# Altium schematic sheet AS_Node_Outputs.SchDoc
size A4
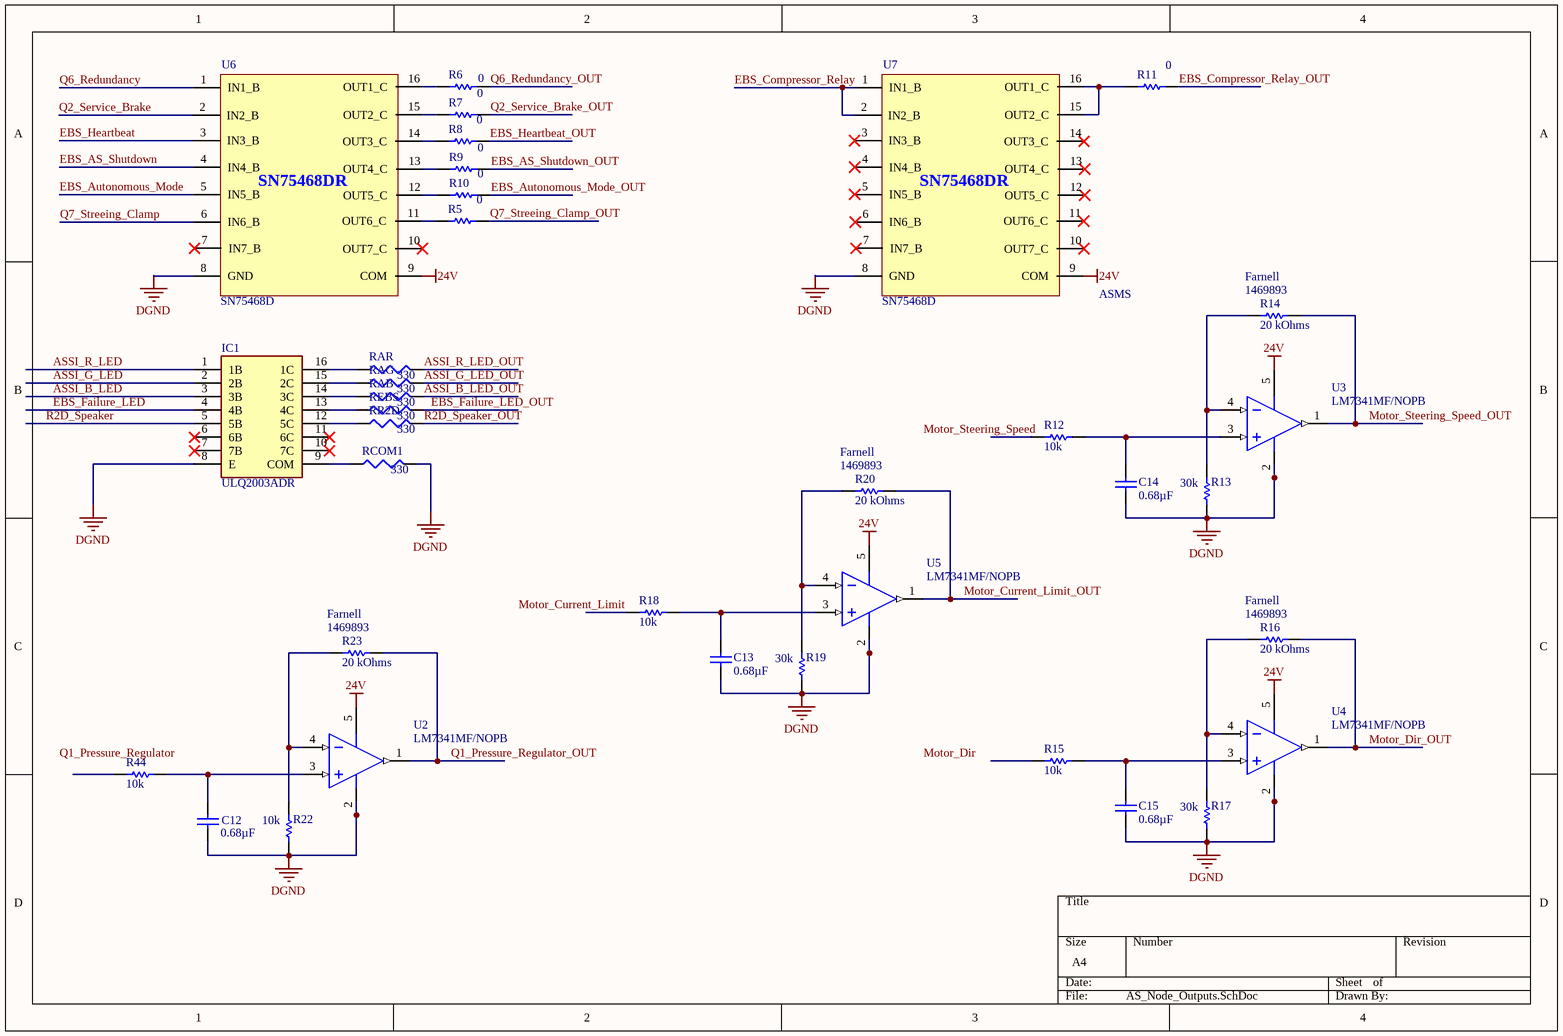
[diagram p0: AS_Node_Outputs.SchDoc]

## Parts
C12  0.68µF  [dV_C0805]
C13  0.68µF  [dV_C0805]
C14  0.68µF  [dV_C0805]
C15  0.68µF  [dV_C0805]
IC1  ULQ2003ADR  [SOIC127P600X175-16N]
R5  0  [dV_R0805]
R6  0  [dV_R0805]
R7  0  [dV_R0805]
R8  0  [dV_R0805]
R9  0  [dV_R0805]
R10  0  [dV_R0805]
R11  0  [dV_R0805]
R12  10k  [dV_R0805]
R13  30k  [dV_R0805]
R14  20 kOhms  Supplier Part Number: 1469893  Supplier: Farnell  [dV_R0805]
R15  10k  [dV_R0805]
R16  20 kOhms  Supplier Part Number: 1469893  Supplier: Farnell  [dV_R0805]
R17  30k  [dV_R0805]
R18  10k  [dV_R0805]
R19  30k  [dV_R0805]
R20  20 kOhms  Supplier Part Number: 1469893  Supplier: Farnell  [dV_R0805]
R22  10k  [dV_R0805]
R23  20 kOhms  Supplier Part Number: 1469893  Supplier: Farnell  [dV_R0805]
R44  10k  [dV_R0805]
RAB  value 330  [SMD-0805-RES]  (hidden comment: Res3)
RAG  value 330  [SMD-0805-RES]  (hidden comment: Res3)
RAR  value 330  [SMD-0805-RES]  (hidden comment: Res3)
RCOM1  value 330  [SMD-0805-RES]  (hidden comment: Res3)
REBS  value 330  [SMD-0805-RES]  (hidden comment: Res3)
RR2D  value 330  [SMD-0805-RES]  (hidden comment: Res3)
U2  LM7341MF/NOPB  [SOT-23-5]
U3  LM7341MF/NOPB  [SOT-23-5]
U4  LM7341MF/NOPB  [SOT-23-5]
U5  LM7341MF/NOPB  [SOT-23-5]
U6  SN75468D  [ULQ2001]
U7  SN75468D  [ULQ2001]

## Nets
24V: U2.5(VDD) U3.5(VDD) U4.5(VDD) U5.5(VDD) U6.9(COM) U7.9(COM)
DGND: C12.1 C13.1 C14.1 C15.1 IC1.8(E) R13.2 R17.2 R19.2 R22.2 RCOM1.2 U2.2(GND) U3.2(GND) U4.2(GND) U5.2(GND) U6.8(GND) U7.8(GND)
ASSI_B_LED: IC1.3(3B)
ASSI_B_LED_OUT: RAB.2
ASSI_G_LED: IC1.2(2B)
ASSI_G_LED_OUT: RAG.2
ASSI_R_LED: IC1.1(1B)
ASSI_R_LED_OUT: RAR.2
EBS_AS_Shutdown: U6.4(IN4_B)
EBS_AS_Shutdown_OUT: R9.2
EBS_Autonomous_Mode: U6.5(IN5_B)
EBS_Autonomous_Mode_OUT: R10.2
EBS_Compressor_Relay: U7.1(IN1_B) U7.2(IN2_B)
EBS_Compressor_Relay_OUT: R11.2
EBS_Failure_LED: IC1.4(4B)
EBS_Failure_LED_OUT: REBS.2
EBS_Heartbeat: U6.3(IN3_B)
EBS_Heartbeat_OUT: R8.2
Motor_Current_Limit_OUT: R20.2 U5.1(OUT)
Motor_Dir_OUT: R16.2 U4.1(OUT)
Motor_Steering_Speed_OUT: R14.2 U3.1(OUT)
Q1_Pressure_Regulator_OUT: R23.2 U2.1(OUT)
Q2_Service_Brake: U6.2(IN2_B)
Q2_Service_Brake_OUT: R7.2
Q6_Redundancy: U6.1(IN1_B)
Q6_Redundancy_OUT: R6.2
Q7_Streeing_Clamp: U6.6(IN6_B)
Q7_Streeing_Clamp_OUT: R5.2
R2D_Speaker: IC1.5(5B)
R2D_Speaker_OUT: RR2D.2
NetC12_2: C12.2 R44.2 U2.3(IN+)
NetC13_2: C13.2 R18.2 U5.3(IN+)
NetC14_2: C14.2 R12.2 U3.3(IN+)
NetC15_2: C15.2 R15.2 U4.3(IN+)
NetIC1_9: IC1.9(COM) RCOM1.1
NetIC1_12: IC1.12(5C) RR2D.1
NetIC1_13: IC1.13(4C) REBS.1
NetIC1_14: IC1.14(3C) RAB.1
NetIC1_15: IC1.15(2C) RAG.1
NetIC1_16: IC1.16(1C) RAR.1
NetR5_1: R5.1 U6.11(OUT6_C)
NetR6_1: R6.1 U6.16(OUT1_C)
NetR7_1: R7.1 U6.15(OUT2_C)
NetR8_1: R8.1 U6.14(OUT3_C)
NetR9_1: R9.1 U6.13(OUT4_C)
NetR10_1: R10.1 U6.12(OUT5_C)
NetR11_1: R11.1 U7.15(OUT2_C) U7.16(OUT1_C)
NetR13_1: R13.1 R14.1 U3.4(IN-)
NetR16_1: R16.1 R17.1 U4.4(IN-)
NetR19_1: R19.1 R20.1 U5.4(IN-)
NetR22_1: R22.1 R23.1 U2.4(IN-)

Not connected (* = marked no-connect by the designer): IC1 6(6B)* 7(7B)* 10(7C)* 11(6C)*; R12 1; R15 1; R18 1; R44 1; U6 7(IN7_B)* 10(OUT7_C)*; U7 3(IN3_B)* 4(IN4_B)* 5(IN5_B)* 6(IN6_B)* 7(IN7_B)* 10(OUT7_C)* 11(OUT6_C)* 12(OUT5_C)* 13(OUT4_C)* 14(OUT3_C)*

## Notes on the sheet
- (near U7) ASMS
- Labels drawn without touching a wire or pin: Motor_Current_Limit, Motor_Dir, Motor_Steering_Speed, Q1_Pressure_Regulator

## Library data of the parts
C12-C15 = Cap: Manufacturer: KEMET; Manufacturer Part Number: C0805C684J3NACTU; Ceramic Capacitor Case: 0805 [2012 Metric]; Voltage Rating: 25; Capacitance Tolerance: ± 5%; Dielectric Characteristic: X8; Product Range: C Series; SVHC: No SVHC (15-Jun-2015)<!--FANDB--><div class="features-and-benefits-container"><div class="features-and-benefits-desc-container"><span class="features-and-benefits-container-desc">SMD Multilayer Ceramic Capacitor, 0805 [2012 Metric], 0.68 µF, 25 V, ± 5%, X8L, C Series</span></div><div class="features-and-benefits-description"><span class="features-benefits-value">The X8L dielectric features a 150°C maximum operating temperature and is considered "general purpose high temperature." These components are fixed, ceramic dielectric capacitors suited for high temperature bypass and decoupling applications or frequency discriminating circuits where Q and stability of capacitance characteristics are not critical. X8L exhibits a predictable change in capacitance with respect to time and voltage and boasts a minimal change in capacitance with reference to ambient temperature up to 125°C. Beyond 125°C X8L displays a wider variation in capacitance. Capacitance change is limited to ±15% from ?55°C to +125°C and +15, ?40% from 125°C to 150°C.</span></div><div class="features-and-benefits-list"><ul class="features-and-benefits-list-list"><li class="features-and-benefits-list-item">Operating temperature range from -55°C to 150°C</li><li class="features-and-benefits-list-item">Capacitance values ranging from 0.012µF to 10µF</li><li class="features-and-benefits-list-item">EIA 0402, 0603, 0805, 1206 and 1210 case sizes available</li><li class="features-and-benefits-list-item">DC voltage rating of 10V, 16V, 25V and 50; Supplier 1: Farnell; Supplier Part Number 1: 2575955; RoHS: YES; Stock 1: 576; Pricing 1: 5=0.718, 50=0.419, 250=0.279, 500=0.228, 1000=0.193, 2500=0.186, 12500=0.179 (GBP); Capacitance: 0.68µF; Packaging: Cut Tape; Operating Temperature Min: -55; Operating Temperature Max: 150; Automotive Qualification Standard: -; MSL: MSL 1 - Unlimited; ComponentLink1URL: http://www.farnell.com/datasheets/2321109.pdf; ComponentLink1Description: http://www.farnell.com/datasheets/2321109.pdf; ComponentLink2URL: https://youtu.be/PxmtxV5n2KM?list=PLa3x8V-ZYWEUNRPUyCTjknYUhI9vvDZu9; ComponentLink2Description: https://youtu.be/PxmtxV5n2KM?list=PLa3x8V-ZYWEUNRPUyCTjknYUhI9vvDZu9; ComponentLink3URL: http://www.farnell.com/datasheets/2315665.pdf; ComponentLink3Description: http://www.farnell.com/datasheets/2315665.pdf; ComponentLink4URL: http://www.farnell.com/cad/2268906.zip; ComponentLink4Description: http://www.farnell.com/cad/2268906.zip
IC1 = ULQ2003ADR: Integrated Circuit; Manufacturer_Name: Texas Instruments; Datasheet Link: http://www.ti.com/lit/ds/symlink/ulq2003a.pdf; Height: 1.75mm; Manufacturer_Part_Number: ULQ2003ADR; Mouser Part Number: 595-ULQ2003ADR; Mouser Price/Stock: https://www.mouser.com/Search/Refine.aspx?Keyword=595-ULQ2003ADR; RS Part Number: 6658696P; RS Price/Stock: http://uk.rs-online.com/web/p/products/6658696P
R5-R11 = Res1: Manufacturer: PANASONIC ELECTRONIC COMPONENTS; Manufacturer Part Number: ERJ6GEY0R00V; Voltage Rating: 150; Resistor Element Material: Thick Film; Resistor Case Style: 0805 [2012 Metric]; Power Rating: 125; Product Range: ERJ6; Temperature Coefficient: -100ppm/°C to +600; Automotive Qualification Standard: AEC-Q200; SVHC: No SVHC (12-Jan-2017); Resistor Mounting: Surface Mount Device<!--FANDB--><div class="features-and-benefits-container"><div class="features-and-benefits-desc-container"><span class="features-and-benefits-container-desc">SMD Chip Resistor, 0 ohm, 150 V, Thick Film, 0805 [2012 Metric], 125 mW</span></div><div class="features-and-benefits-description"><span class="features-benefits-value">The Panasonic ERJ 6G series resistors are automotive grade thick film chip resistors. The resistance range includes E24 decade values from 1ohm to 10Mohm. ERJ series resistors have metal glaze thick film resistive element and three layers of electrodes that make them highly reliable.</span></div><div class="features-and-benefits-list"><ul class="features-and-benefits-list-list"><li class="features-and-benefits-list-item">EIA 01005, 0201, 0402, 0603, 0805, 1206, 1210, 1812, 2010, 2512 case sizes available</li><li class="features-and-benefits-list-item">Small size, low weight resistors</li><li class="features-and-benefits-list-item">Automotive grade AEC-Q200 compliant</li><li class="features-and-benefits-list-item">Maximum power rating of 1W</li><li class="features-and-benefits-list-item">Tolerance of ±5%</li><li class="features-and-benefits-list-item">Temperature coefficient (TCR) of -100 to +600, -400 to +150, ±300 and ±200ppm/°C</li><li class="features-and-benefits-list-item">Available in -55°C to 125°C and -55°C to 155°C operating temperature ranges</li><li class="features-and-benefits-list-item">Meets IEC 60115-8, JIS C 5201-8, EIAJ RC-2134; Supplier 1: Farnell; Supplier Part Number 1: 2057661; RoHS: YES; Stock 1: 44841; Pricing 1: 10=0.0144, 100=0.009, 500=0.0062, 1000=0.0054, 2500=0.0042 (GBP); Resistance: 0; Resistance Tolerance: -; Packaging: Cut Tape; ComponentLink1URL: http://www.farnell.com/datasheets/2371628.pdf; ComponentLink1Description: http://www.farnell.com/datasheets/2371628.pdf
R12 R15 R18 R22 R44 = Res1: Manufacturer: PANASONIC ELECTRONIC COMPONENTS; Manufacturer Part Number: ERA6AEB103V; Voltage Rating: 100; Resistor Element Material: Thin Film; Resistor Case Style: 0805 [2012 Metric]; Power Rating: 125; Resistance Tolerance: ± 0.1%; Product Range: ERA6; Temperature Coefficient: ± 25; Automotive Qualification Standard: AEC-Q200; SVHC: No SVHC (07-Jul-2017); No. of Pins: 2; Resistor Mounting: Surface Mount Device<!--FANDB--><div class="features-and-benefits-container"><div class="features-and-benefits-desc-container"><span class="features-and-benefits-container-desc">SMD Chip Resistor, 10 kohm, 100 V, Thin Film, 0805 [2012 Metric], 125 mW, ± 0.1%</span></div><div class="features-and-benefits-description"><span class="features-benefits-value">The Panasonic ERA 6A series resistors are highly reliable, automotive grade metal film chip resistors based on thin film technology. The resistance range includes E24 and E96 decade values from 10 ohm to 1Mohm. ERA series metal thin film chip resistors have small resistance tolerance and temperature coefficient of resistance, low current noise and excellent linearity. These resistors are stable at high temperature and humidity.</span></div><div class="features-and-benefits-list"><ul class="features-and-benefits-list-list"><li class="features-and-benefits-list-item">EIA 0201, 0402, 0603, 0805, 1206 case sizes available</li><li class="features-and-benefits-list-item">Automotive grade AEC-Q200 compliant</li><li class="features-and-benefits-list-item">Meets IEC 60115-8, JIS C 5201-8, EIAJ RC-2133B standards</li><li class="features-and-benefits-list-item">85°C 85% RH rated load</li><li class="features-and-benefits-list-item">Maximum power rating of 250mW</li><li class="features-and-benefits-list-item">Available in ±0.05%, ±0.1%, ±0.25% and ±0.5% tolerance</li><li class="features-and-benefits-list-item">±10, ±15, ±25, ±50 and ±100ppm/°C TCR values available</li><li class="features-and-benefits-list-item">Operating temperature range -55°C to 155; Supplier 1: Farnell; Supplier Part Number 1: 1577673; RoHS: YES; Stock 1: 159335; Pricing 1: 10=0.237, 100=0.0981, 500=0.08, 1000=0.0561, 2500=0.0491 (GBP); Resistance: 10k; Packaging: Cut Tape; Operating Temperature Max: 155; Operating Temperature Min: -55; Operating Temperature Range: -55°C to +155; ComponentLink1URL: http://www.farnell.com/datasheets/2052875.pdf; ComponentLink1Description: http://www.farnell.com/datasheets/2052875.pdf; ComponentLink2URL: http://www.farnell.com/datasheets/1718548.pdf; ComponentLink2Description: http://www.farnell.com/datasheets/1718548.pdf; ComponentLink3URL: http://www.farnell.com/cad/1684672.zip; ComponentLink3Description: http://www.farnell.com/cad/1684672.zip
R13 R17 R19 = Res1: Manufacturer: Panasonic; Manufacturer Part Number: ERA-6AEB303V; Resistor Case Style: 0805 [2012 Metric]; Resistor Element Material: Thin Film; SVHC: No SVHC (16-Dec-2013); Temperature Coefficient: ± 25ppm/°C; Power Rating: 125mW; Voltage Rating: 100V; Resistance Tolerance: ± 0.1%; Resistor Mounting: SMD; No. of Pins: 2; Resistance: 30kohm; Product Range: PANASONIC - ERA Series; Reel Quantity: 5000; Operating Temperature Min: -55°C; Operating Temperature Max: 155°C; Operating Temperature Range: -55°C to +155°C; Supplier: Farnell; Series: ERA; Packaging: Tape & Reel; Package / Case: 0805; Supplier Part Number: 1670247
R14 R16 R20 R23 = Res1: Manufacturer Part Number: CRCW080520K0FKEA; Manufacturer: Vishay; Power Rating: 125 mW (1/8 W); Unit Weight: 0.000194 oz; Qualification: Commercial; Tolerance: 1 %; Temperature Coefficient: 100 PPM / K; Brand: Vishay / Dale; Voltage Rating: 150 V; Packaging: Reel; Product: Thick Film Resistors SMD; Factory Pack Quantity: 5000; Resistance: 20 kOhms; Features: Metal glaze on high quality ceramic; Width: 1.25 mm; Product Category: Thick Film Resistors - SMD; Case Code - in: 0805; Package / Case: 0805 (2012 metric); Length: 2 mm; Operating Temperature Range: - 55 C to + 155 C; Termination Style: SMD/SMT; Height: 0.45 mm; Series: CRCW; RoHS: True; Case Code - mm: 2012
RAB RAG RAR RCOM1 REBS RR2D = Res3: Resistor; Published: 8-Jun-2000; LatestRevisionDate: 29-May-2009; LatestRevisionNote: IPC-7351 Footprint Added.; PackageReference: J1-0603; Publisher: Altium Limited; PackageDescription: Chip Resistor
U2-U5 = TLV2371IDBVT: 550 uA/Ch, 3 MHz, RRIO Operational Amplifier, 2.7 to 16 V, -40 to 125 degC, 5-pin SOT23 (DBV5), Green (RoHS & no Sb/Br); Manufacturer: TEXAS INSTRUMENTS; No. of Amplifiers: 1 Amplifier; Bandwidth: 3; Slew Rate: 2; Supply Voltage Range: 2.7V to 32; Amplifier Case Style: SOT-23; No. of Pins: 5; SVHC: No SVHC (07-Jul-2017); Amplifier Type: CMOS; Base Number: 2371; Gain Bandwidth: 2.4; I/O Type: Rail-Rail I/O; Input Offset Voltage Max: 4.5; Op Amp Type: Low Power; Supply Voltage + Nom: 16; Supply Voltage Min: 2.7V<!--FANDB--><div class="features-and-benefits-container"><div class="features-and-benefits-description"><span class="features-benefits-value">The TLV2371IDBVT is a Single Supply Operational Amplifier provides rail-to-rail input and output capability. The TLV2371IDBVT takes the minimum operating supply voltage down to 2.7V over the extended industrial temperature range while adding the rail-to-rail output swing feature. The TLV2371IDBVT also provides 3MHz bandwidth from only 550µA. The maximum recommended supply voltage is 16V, which allows the devices to be operated from (±8V supplies down to ±1.35V) a variety of rechargeable cells. The CMOS inputs enable use in high-impedance sensor interfaces, with the lower voltage operation making an ideal alternative for the TLC227x in battery-powered applications. The rail-to-rail input stage further increases its versatility. The TLV2371IDBVT is the seventh member of a rapidly growing number of RRIO products available from TI and it is the first to allow operation up to 16V rails with good AC performance.</span></div><div class="features-and-benefits-list"><ul class="features-and-benefits-list-list"><li class="features-and-benefits-list-item">Rail-to-rail input/output</li><li class="features-and-benefits-list-item">3MHz Wide bandwidth</li><li class="features-and-benefits-list-item">2.4V/µs High slew rate</li><li class="features-and-benefits-list-item">550µA Supply current per channel</li><li class="features-and-benefits-list-item">IDD(SHDN) 25µA Low power shutdown mode per channel</li><li class="features-and-benefits-list-item">39nV/Hz Input noise voltage</li><li class="features-and-benefits-list-item">1; Supplier 1: Farnell; Supplier Part Number 1: 1663016; Manufacturer Part Number: LM7341MF/NOPB; RoHS: YES; Stock 1: 4763; Pricing 1: 1=1.33, 10=1.06, 25=1, 50=0.976, 100=0.768 (GBP); Operating Temperature Min: -40; Operating Temperature Max: 125; Packaging: Cut Tape; Product Range: -; Automotive Qualification Standard: -; RoHS Phthalates Compliant: Yes; MSL: MSL 1 - Unlimited; Amplifer Supply Voltage: 2.7V to 32; IC Generic Number: 2371; Operating Temperature Range: -40°C to +125; Supply Voltage Max: 16; ComponentLink1URL: https://se.farnell.com/texas-instruments/lm7341mf-nopb/amp-r-r-i-o-4-6mhz-30v-sot23-5/dp/1663016?scope=partnumberlookahead&ost=1663016&searchref=searchlookahead&exaMfpn=true&ddkey=https%3Ase-SE%2FElement14_Sweden%2Fw%2Fsearch; ComponentLink1Description: https://se.farnell.com/texas-instruments/lm7341mf-nopb/amp-r-r-i-o-4-6mhz-30v-sot23-5/dp/1663016?scope=partnumberlookahead&ost=1663016&searchref=searchlookahead&exaMfpn=true&ddkey=https%3Ase-SE%2FElement14_Sweden%2Fw%2Fsearch; ComponentLink2URL: https://se.farnell.com/texas-instruments/lm7341mf-nopb/amp-r-r-i-o-4-6mhz-30v-sot23-5/dp/1663016?scope=partnumberlookahead&ost=1663016&searchref=searchlookahead&exaMfpn=true&ddkey=https%3Ase-SE%2FElement14_Sweden%2Fw%2Fsearch; ComponentLink2Description: https://se.farnell.com/texas-instruments/lm7341mf-nopb/amp-r-r-i-o-4-6mhz-30v-sot23-5/dp/1663016?scope=partnumberlookahead&ost=1663016&searchref=searchlookahead&exaMfpn=true&ddkey=https%3Ase-SE%2FElement14_Sweden%2Fw%2Fsearch; ComponentLink3URL: https://se.farnell.com/texas-instruments/lm7341mf-nopb/amp-r-r-i-o-4-6mhz-30v-sot23-5/dp/1663016?scope=partnumberlookahead&ost=1663016&searchref=searchlookahead&exaMfpn=true&ddkey=https%3Ase-SE%2FElement14_Sweden%2Fw%2Fsearch; ComponentLink3Description: https://se.farnell.com/texas-instruments/lm7341mf-nopb/amp-r-r-i-o-4-6mhz-30v-sot23-5/dp/1663016?scope=partnumberlookahead&ost=1663016&searchref=searchlookahead&exaMfpn=true&ddkey=https%3Ase-SE%2FElement14_Sweden%2Fw%2Fsearch; ComponentLink4URL: https://se.farnell.com/texas-instruments/lm7341mf-nopb/amp-r-r-i-o-4-6mhz-30v-sot23-5/dp/1663016?scope=partnumberlookahead&ost=1663016&searchref=searchlookahead&exaMfpn=true&ddkey=https%3Ase-SE%2FElement14_Sweden%2Fw%2Fsearch; ComponentLink4Description: https://se.farnell.com/texas-instruments/lm7341mf-nopb/amp-r-r-i-o-4-6mhz-30v-sot23-5/dp/1663016?scope=partnumberlookahead&ost=1663016&searchref=searchlookahead&exaMfpn=true&ddkey=https%3Ase-SE%2FElement14_Sweden%2Fw%2Fsearch
U6 U7 = SN75468DR: Manufacturer: Texas Instruments; Transistor Polarity: NPN; Collector Emitter Voltage V(br)ceo: 100V; DC Collector Current: 500mA; Transistor Case Style: SOIC; No. of Pins: 16Pins; SVHC: No SVHC (15-Jun-2015); Base Number: 75468; Current Ic Continuous a Max: 500; Device Type: LED; IC Temperature Range: Commercial; Input Type: CMOS, TTL; Module Configuration: Seven; No. of Channels: 7; Output Voltage Max: 100; Supply Voltage Max: 15; Supply Voltage Min: 6V<!--FANDB--><div class="features-and-benefits-container"><div class="features-and-benefits-description"><span class="features-benefits-value">The SN75468D is a high-current Transistor Array consists of seven NPN Darlington pairs that feature high-voltage outputs with common-cathode clamp diodes for switching inductive loads. The collector-current rating of each Darlington pair is 500mA. The Darlington pairs may be paralleled for higher current capability. Applications include relay drivers, hammer drivers, lamp drivers, display drivers (LED and gas discharge), line drivers and logic buffers. The device has a 2700; Supplier 1: Farnell; Supplier Part Number 1: 9593004; Manufacturer Part Number: SN75468D; RoHS: YES; Stock 1: 903; Pricing 1: 5=0.744, 25=0.621, 100=0.436, 250=0.426, 500=0.377, 1000=0.274, 5000=0.259 (GBP); Power Dissipation Pd: -; DC Current Gain hFE: -; Operating Temperature Max: 70°C; Product Range: -; Automotive Qualification Standard: -; MSL: MSL 1 - Unlimited; IC Generic Number: 75468; No. of Transistors: 7; Operating Temperature Min: 0; Operating Temperature Range: 0°C to +70; Output Current Max: 500; Output Source Current Min: 500; ComponentLink1URL: http://www.ti.com/general/docs/lit/getliterature.tsp?genericPartNumber=SN75468&amp;&amp;fileType=pdf; ComponentLink1Description: http://www.ti.com/general/docs/lit/getliterature.tsp?genericPartNumber=SN75468&amp;&amp;fileType=pdf; ComponentLink2URL: http://www.farnell.com/cad/1613391.zip; ComponentLink2Description: http://www.farnell.com/cad/1613391.zip; Supplier: Mouser; Supplier Part Number: 595-SN75468D